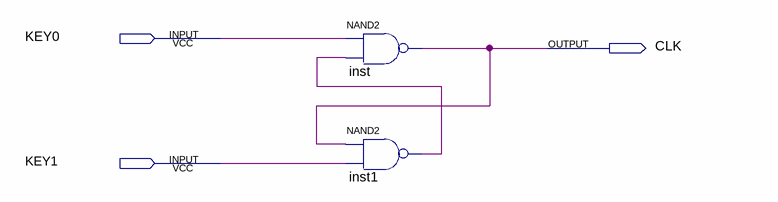
[diagram p0: schematic sheet]
// Quartus schematic Latch_NAND.bdf as structural Verilog: 2 symbols, 3 pins
module Latch_NAND (
  input  KEY0,
  input  KEY1,
  output CLK
);

  wire inst1_out;

  nand inst (CLK, KEY0, inst1_out);
  nand inst1 (inst1_out, CLK, KEY1);
endmodule
